# Altium schematic sheet SchemaDriverMoteur.SchDoc
size A4
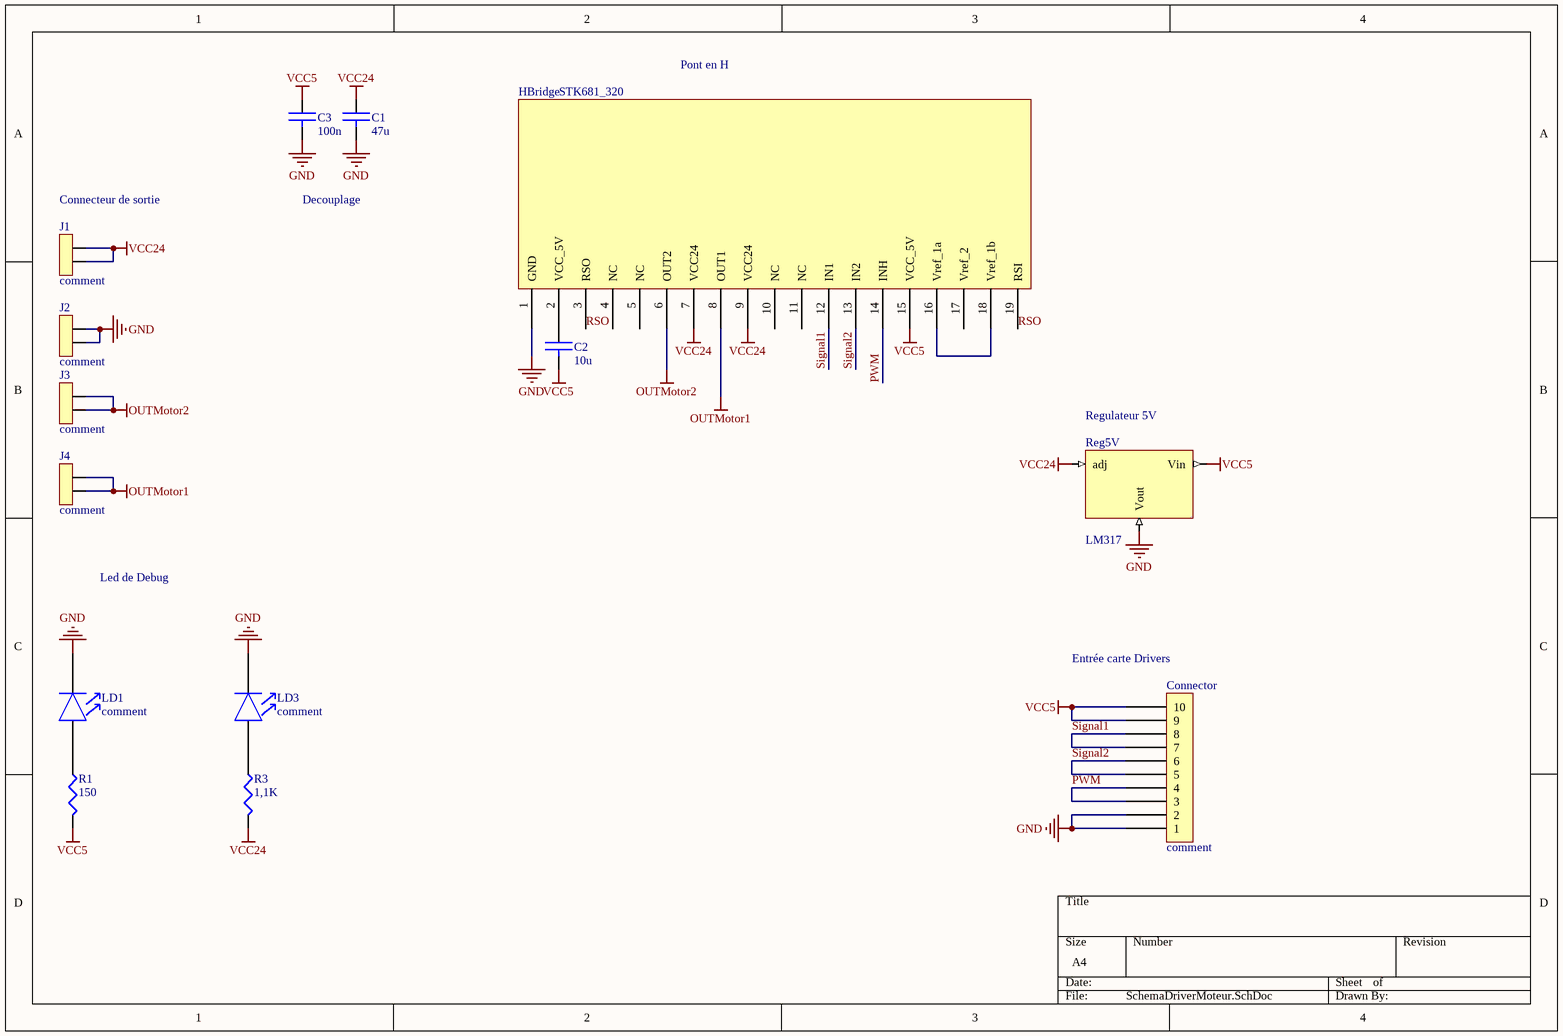
[diagram p0: SchemaDriverMoteur.SchDoc]

## Parts
C1  value 47u  [RAD0.1]  (hidden comment: CAP)
C2  value 10u  [RAD0.1]  (hidden comment: CAP)
C3  value 100n  [0805]  (hidden comment: CAP)
Connector  comment  [HE10-10V]
HBridge  STK681_320  [stk681_320]
J1  comment  [AMP_2]
J2  comment  [AMP_2]
J3  comment  [AMP_2]
J4  comment  [AMP_2]
LD1  comment  [LED0805]
LD3  comment  [LED0805]
R1  value 150  [0805]  (hidden comment: RES)
R3  value 1,1K  [0805]  (hidden comment: RES)
Reg5V  LM317  [TO220V]

## Nets
GND: C1.2 C3.2 Connector.1 Connector.2 HBridge.1(GND) J2.1 J2.2 LD1.K LD3.K Reg5V.2(Vout)
OUTMotor1: HBridge.8(OUT1) J4.1 J4.2
OUTMotor2: HBridge.6(OUT2) J3.1 J3.2
VCC5: C2.2 C3.1 Connector.9 Connector.10 HBridge.15(VCC_5V) R1.2 Reg5V.3(Vin)
VCC24: C1.1 HBridge.7(VCC24) HBridge.9(VCC24) J1.1 J1.2 R3.2 Reg5V.1(adj)
PWM: Connector.3 Connector.4 HBridge.14(INH)
RSO: HBridge.3(RSO) HBridge.19(RSI)
Signal1: Connector.7 Connector.8 HBridge.12(IN1)
Signal2: Connector.5 Connector.6 HBridge.13(IN2)
NetC2_1: C2.1 HBridge.2(VCC_5V)
NetHBridge_16: HBridge.16(Vref_1a) HBridge.18(Vref_1b)
NetLD1_A: LD1.A R1.1
NetLD3_A: LD3.A R3.1

Not connected (* = marked no-connect by the designer): HBridge 4(NC) 5(NC) 10(NC) 11(NC) 17(Vref_2)

## Notes on the sheet
- Pont en H
- (near J1) Connecteur de sortie
- Decouplage
- (near Reg5V) Regulateur 5V
- Led de Debug
- (near Connector) Entrée carte Drivers

## Library data of the parts
C1-C3 = CAP: capacité non polarisée
Connector = HE10-10: 10-pin connector
J1-J4 = POWER2: connecteur alim 2 pôles
LD1 LD3 = LED: LED 5mm/3mm/CMS
R1 R3 = RES: resistance
Reg5V = REG_ADJ_POS: régulateur positif ajustable